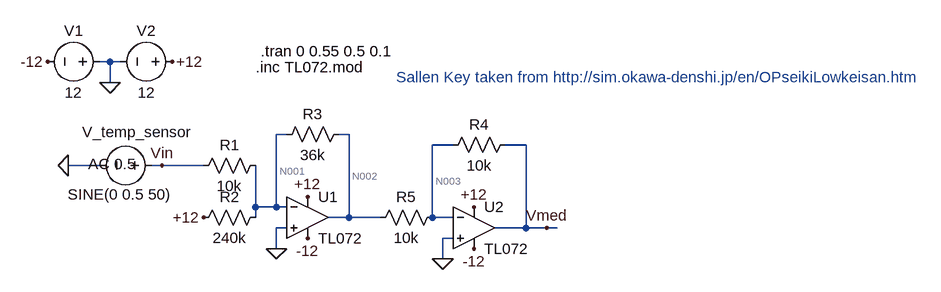
[diagram p0: schematic signal_conditioning_circuit_without_filter.asc]
signal_conditioning_circuit_without_filter.asc, the LTspice schematic file:
Version 4
SHEET 1 1648 680
WIRE -64 -80 -80 -80
WIRE -48 -80 -64 -80
WIRE -64 -48 -64 -80
WIRE 208 32 192 32
WIRE 304 32 288 32
WIRE 464 48 432 48
WIRE 576 48 544 48
WIRE -80 80 -128 80
WIRE 16 80 0 80
WIRE 80 80 16 80
WIRE 160 144 160 80
WIRE 192 144 192 32
WIRE 192 144 160 144
WIRE 208 144 192 144
WIRE 160 160 160 144
WIRE 304 160 304 32
WIRE 304 160 272 160
WIRE 352 160 304 160
WIRE 432 160 432 48
WIRE 464 160 432 160
WIRE 208 176 192 176
WIRE 576 176 576 48
WIRE 576 176 528 176
WIRE 608 176 576 176
WIRE 624 176 608 176
WIRE 464 192 448 192
WIRE 192 208 192 176
WIRE 448 224 448 192
FLAG -64 -48 0
FLAG 32 -80 +12
FLAG -160 -80 -12
FLAG 240 192 -12
FLAG 240 128 +12
FLAG 192 208 0
FLAG 80 160 +12
FLAG 16 80 Vin
FLAG 496 208 -12
FLAG 496 144 +12
FLAG 448 224 0
FLAG 608 176 Vmed
FLAG -128 80 0
SYMBOL Opamps\\opamp2 240 96 R0
SYMATTR InstName U1
SYMATTR Value TL072
SYMBOL voltage -64 -80 R90
WINDOW 0 -32 56 VBottom 2
WINDOW 3 32 56 VTop 2
WINDOW 123 0 0 Left 0
WINDOW 39 0 0 Left 0
SYMATTR InstName V1
SYMATTR Value 12
SYMBOL voltage 48 -80 R90
WINDOW 0 -32 56 VBottom 2
WINDOW 3 32 56 VTop 2
WINDOW 123 0 0 Left 0
WINDOW 39 0 0 Left 0
SYMATTR InstName V2
SYMATTR Value 12
SYMBOL res 176 64 R90
WINDOW 0 0 56 VBottom 2
WINDOW 3 32 56 VTop 2
SYMATTR InstName R1
SYMATTR Value 10k
SYMBOL res 176 144 R90
WINDOW 0 0 56 VBottom 2
WINDOW 3 32 56 VTop 2
SYMATTR InstName R2
SYMATTR Value 240k
SYMBOL res 304 16 R90
WINDOW 0 0 56 VBottom 2
WINDOW 3 32 56 VTop 2
SYMATTR InstName R3
SYMATTR Value 36k
SYMBOL voltage 16 80 R90
WINDOW 0 -36 38 VBottom 2
WINDOW 3 60 65 VBottom 2
WINDOW 123 13 77 VBottom 2
WINDOW 39 0 0 Left 0
SYMATTR InstName V_temp_sensor
SYMATTR Value SINE(0 0.5 50)
SYMATTR Value2 AC 0.5
SYMBOL Opamps\\opamp2 496 112 R0
SYMATTR InstName U2
SYMATTR Value TL072
SYMBOL res 560 32 R90
WINDOW 0 0 56 VBottom 2
WINDOW 3 32 56 VTop 2
SYMATTR InstName R4
SYMATTR Value 10k
SYMBOL res 448 144 R90
WINDOW 0 0 56 VBottom 2
WINDOW 3 32 56 VTop 2
SYMATTR InstName R5
SYMATTR Value 10k
TEXT 168 -96 Left 2 !.tran 0 0.55 0.5 0.1
TEXT 160 -72 Left 2 !.inc TL072.mod
TEXT 376 -56 Left 2 ;Sallen Key taken from http://sim.okawa-denshi.jp/en/OPseikiLowkeisan.htm

The netlist it stands for:
* signal_conditioning_circuit_without_filter.asc
XU1 0 N001 +12 -12 N002 TL072  ; pins In+ In- V+ V- OUT
V1 0 -12 12
V2 +12 0 12
R1 N001 Vin 10k
R2 N001 +12 240k
R3 N002 N001 36k
V_temp_sensor Vin 0 SINE(0 0.5 50) AC 0.5
XU2 0 N003 +12 -12 Vmed TL072  ; pins In+ In- V+ V- OUT
R4 Vmed N003 10k
R5 N003 N002 10k
.tran 0 0.55 0.5 0.1
.inc TL072.mod
* Sallen Key taken from http://sim.okawa-denshi.jp/en/OPseikiLowkeisan.htm
.backanno
.end

* Results of the author's LTspice run, read from the files saved beside the schematic
* Operating Point, zero values left out:
*   V(n002) = -1.8 V
*   V(-12) = -12 V
*   V(+12) = 12 V
*   V(n001) = 19.12 µV
*   V(vmed) = 1.8 V
*   V(n003) = 2.889 µV
*   I(R5) = 180 µA
*   I(R4) = 180 µA
*   I(R3) = -50 µA
*   I(R2) = -50 µA
*   I(R1) = 1.912 nA
*   I(V_temp_sensor) = 1.912 nA
*   I(V2) = -22.84 mA
*   I(V1) = -22.79 mA
*   Ix(u1:1) = 42.05 pA
*   Ix(u1:2) = 42.05 pA
*   Ix(u1:3) = 11.39 mA
*   Ix(u1:4) = -11.39 mA
*   Ix(u1:5) = 230 µA
*   Ix(u2:1) = 42.05 pA
*   Ix(u2:2) = 42.05 pA
*   Ix(u2:3) = 11.39 mA
*   Ix(u2:4) = -11.39 mA
*   Ix(u2:5) = -180 µA
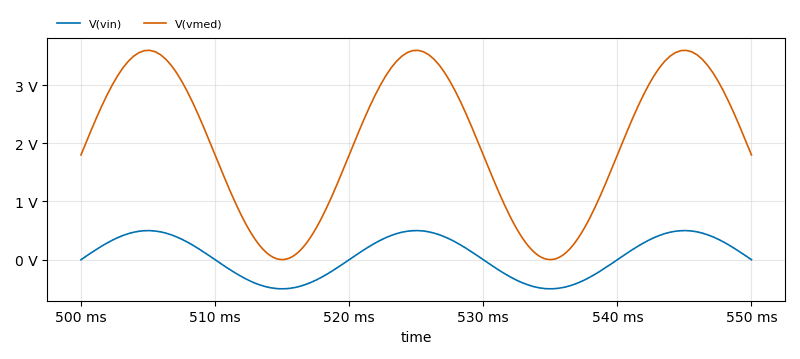
[diagram p1: Transient Analysis of signal_conditioning_circuit_without_filter.asc, plotted from the saved traces]
* Transient Analysis, 1 run:
*   V(vin): min -499.9 mV, max 499.5 mV, average 63.48 mV, rms 353.6 mV, last 0 V
*   V(vmed): min 2.119 mV, max 3.596 V, average 2.028 V, rms 2.383 V, last 1.8 V